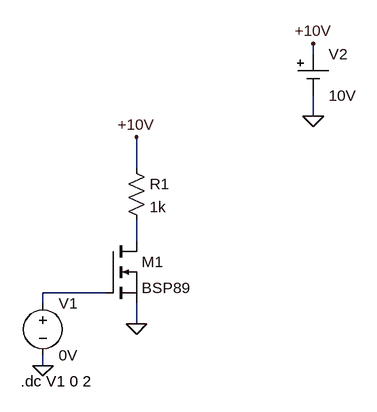
[diagram p0: schematic Lab 1 MOSFET standard part.asc]
Lab 1 MOSFET standard part.asc, the LTspice schematic file:
Version 4
SHEET 1 880 680
WIRE 496 -176 496 -192
WIRE 496 -80 496 -112
WIRE 224 0 224 -48
WIRE 224 112 224 80
WIRE 176 192 80 192
WIRE 80 208 80 192
WIRE 224 240 224 208
WIRE 80 304 80 288
FLAG 80 304 0
FLAG 224 240 0
FLAG 496 -80 0
FLAG 496 -192 +10V
FLAG 224 -48 +10V
SYMBOL nmos 176 112 R0
SYMATTR InstName M1
SYMATTR Value BSP89
SYMBOL voltage 80 192 R0
WINDOW 123 0 0 Left 0
WINDOW 39 0 0 Left 0
SYMATTR InstName V1
SYMATTR Value 0V
SYMBOL res 208 -16 R0
SYMATTR InstName R1
SYMATTR Value 1k
SYMBOL Misc\\cell 496 -176 R0
WINDOW 123 0 0 Left 0
WINDOW 39 0 0 Left 0
SYMATTR InstName V2
SYMATTR Value 10V
TEXT 46 328 Left 2 !.dc V1 0 2

The netlist it stands for:
* Lab 1 MOSFET standard part.asc
M1 N001 N002 0 0 BSP89
V1 N002 0 0V
R1 +10V N001 1k
V2 +10V 0 10V
.model NMOS NMOS
.model PMOS PMOS
.lib standard.mos
.dc V1 0 2
.backanno
.end